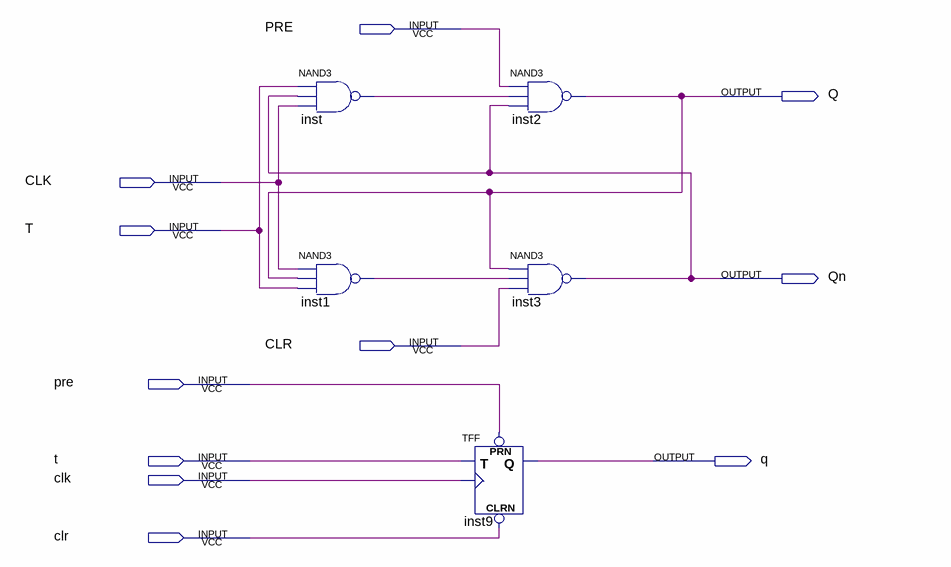
[diagram p0: schematic sheet]
// Quartus schematic JKFF.bdf as structural Verilog: 5 symbols, 11 pins
module JKFF (
  input  PRE,
  input  CLK,
  input  T,
  input  CLR,
  output Q,
  output Qn
);

  wire inst1_out, inst_out;

  nand inst (inst_out, T, Qn, CLK);
  nand inst1 (inst1_out, CLK, Q, T);
  TFF inst9 (.PRN(PRE), .CLRN(CLR), .T(T), .CLK(CLK), .Q(Q));
  nand inst2 (Q, PRE, inst_out, Qn);
  nand inst3 (Qn, Q, inst1_out, CLR);
endmodule
